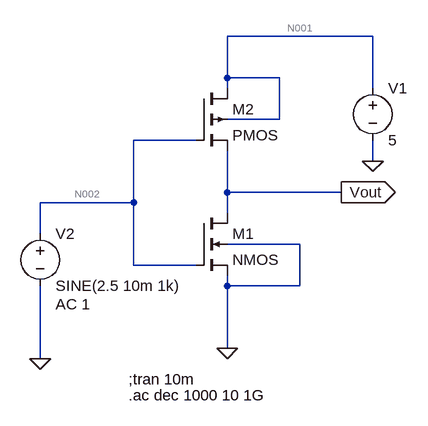
[diagram p0: schematic Amplifier.asc]
Amplifier.asc, the LTspice schematic file:
Version 4
SHEET 1 880 680
WIRE 448 -80 224 -80
WIRE 224 -16 224 -80
WIRE 304 -16 224 -16
WIRE 224 0 224 -16
WIRE 448 0 448 -80
WIRE 304 48 304 -16
WIRE 304 48 224 48
WIRE 176 80 80 80
WIRE 448 112 448 80
WIRE 224 160 224 96
WIRE 400 160 224 160
WIRE 80 176 80 80
WIRE 80 176 -64 176
WIRE 224 192 224 160
WIRE -64 224 -64 176
WIRE 336 240 224 240
WIRE 80 272 80 176
WIRE 176 272 80 272
WIRE 224 304 224 288
WIRE 336 304 336 240
WIRE 336 304 224 304
WIRE 224 400 224 304
WIRE -64 416 -64 304
FLAG 448 112 0
FLAG 224 400 0
FLAG -64 416 0
FLAG 400 160 Vout
IOPIN 400 160 Out
SYMBOL nmos4 176 192 R0
SYMATTR InstName M1
SYMBOL pmos4 176 0 R0
SYMATTR InstName M2
SYMBOL voltage 448 -16 R0
WINDOW 123 0 0 Left 0
WINDOW 39 0 0 Left 0
SYMATTR InstName V1
SYMATTR Value 5
SYMBOL voltage -64 208 R0
WINDOW 123 24 124 Left 2
WINDOW 39 0 0 Left 0
SYMATTR InstName V2
SYMATTR Value SINE(2.5 10m 1k)
SYMATTR Value2 AC 1
TEXT 72 448 Left 2 !;tran 10m
TEXT 72 472 Left 2 !.ac dec 1000 10 1G

The netlist it stands for:
* Amplifier.asc
M1 Vout N002 0 0 NMOS
M2 N001 N002 Vout N001 PMOS
V1 N001 0 5
V2 N002 0 SINE(2.5 10m 1k) AC 1
.model NMOS NMOS
.model PMOS PMOS
.lib standard.mos
;tran 10m
.ac dec 1000 10 1G
.backanno
.end

* Results of the author's LTspice run, read from the files saved beside the schematic
* Operating Point, zero values left out:
*   V(vout) = 2.498 V
*   V(n002) = 2.5 V
*   V(n001) = 5 V
*   Id(M2) = 62.5 µA
*   Ib(M2) = 2.512 pA
*   Is(M2) = -62.5 µA
*   Id(M1) = 62.5 µA
*   Ib(M1) = -2.508 pA
*   Is(M1) = -62.5 µA
*   I(V1) = -62.5 µA